# EAGLE design osc (EAGLE 6.1)
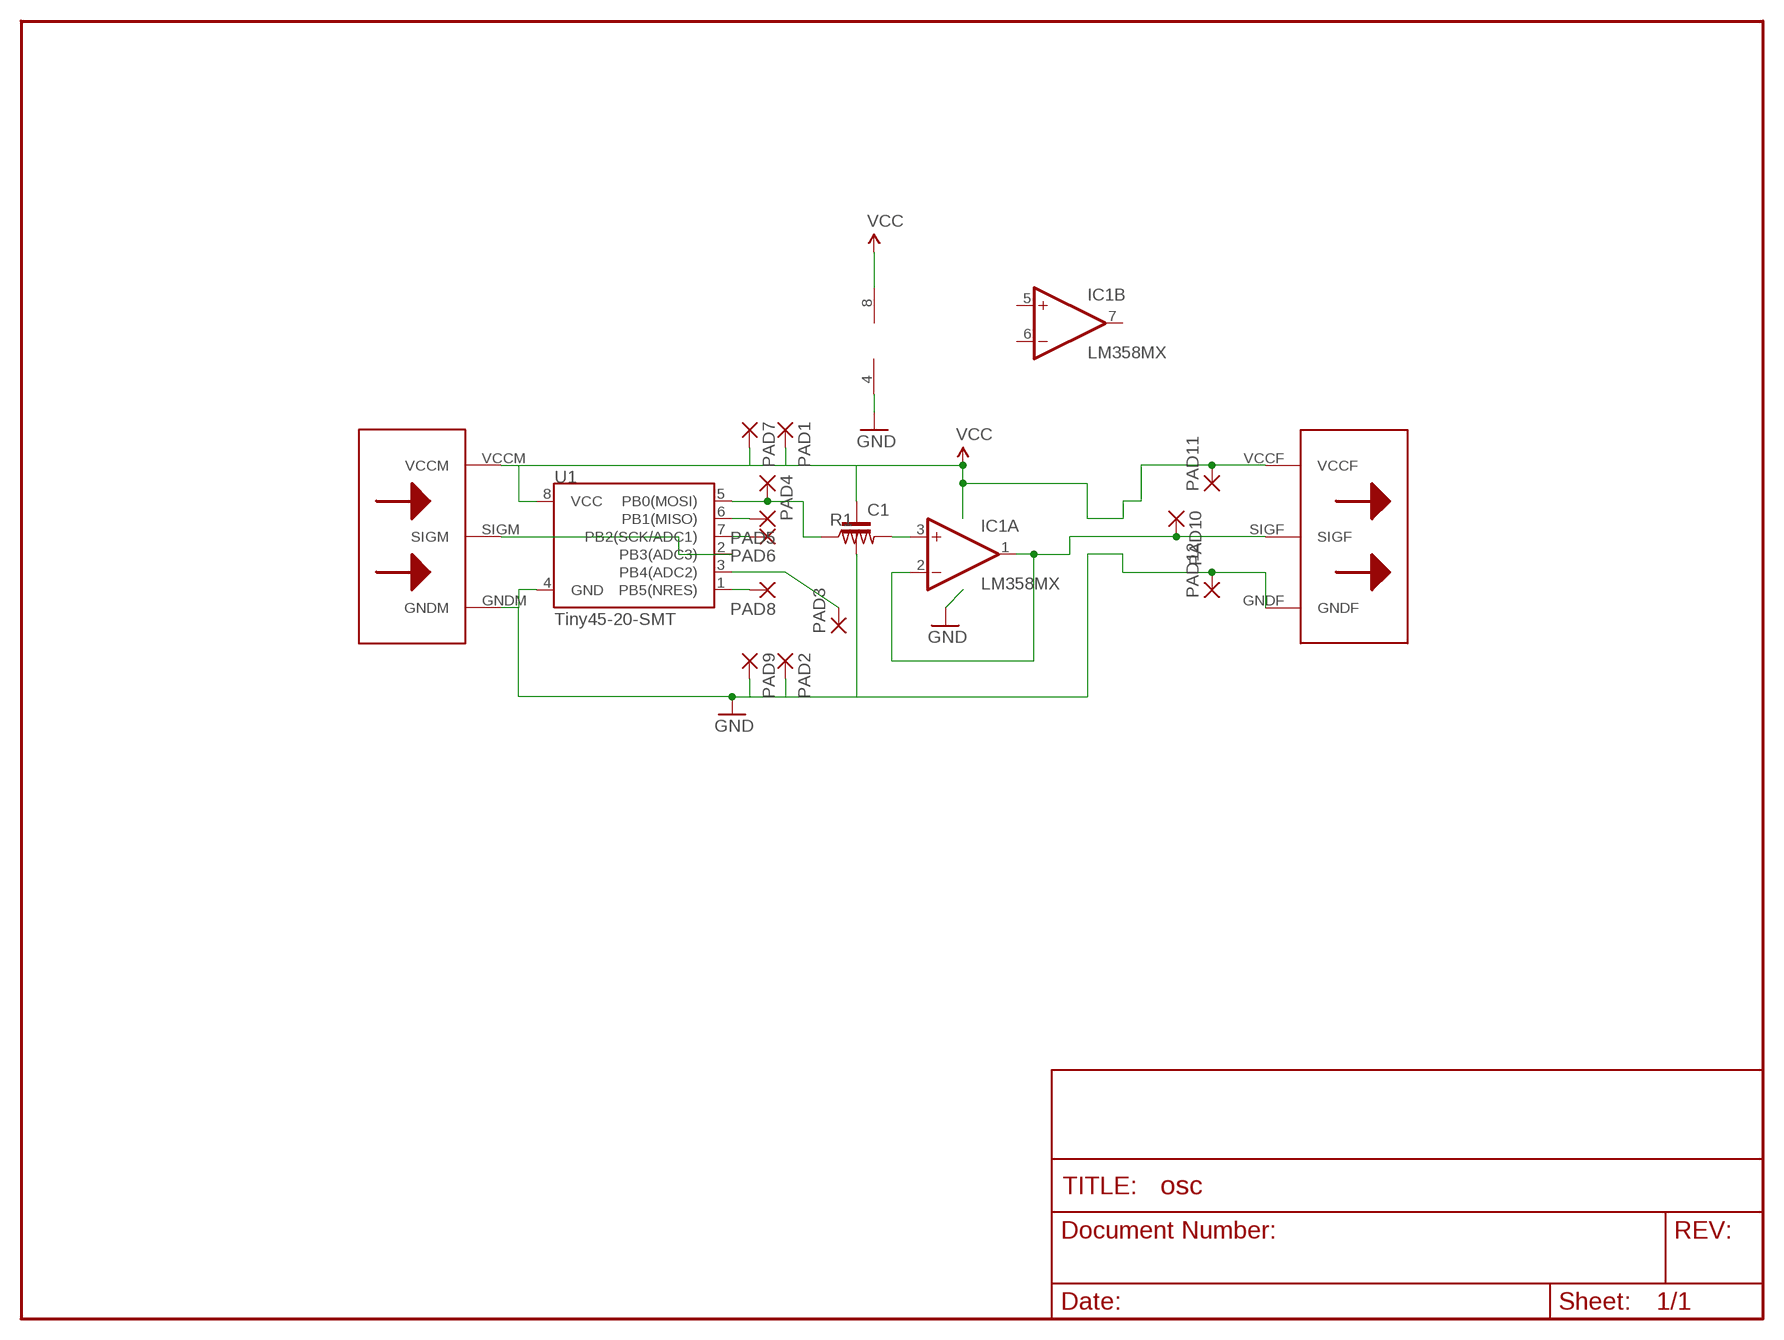
[diagram p0: schematic, sheet 1]

## Parts
C1  C-EUC1206K  [C1206K]
IC1  LM358MX  [SO08]
PAD1  SMD2  [SMD1,27-2,54]
PAD2  SMD2  [SMD1,27-2,54]
PAD3  SMD2  [SMD1,27-2,54]
PAD4  SMD2  [SMD1,27-2,54]
PAD5  SMD2  [SMD1,27-2,54]
PAD6  SMD2  [SMD1,27-2,54]
PAD7  SMD2  [SMD1,27-2,54]
PAD8  SMD2  [SMD1,27-2,54]
PAD9  SMD2  [SMD1,27-2,54]
PAD10  SMD2  [SMD1,27-2,54]
PAD11  SMD2  [SMD1,27-2,54]
PAD12  SMD2  [SMD1,27-2,54]
R1  R-US_R0805  [R0805]
U1  Tiny45-20-SMT  ATTINY45TINY45-20-SMT  [SO08-EIAJ]
U$6  BIGBIT  [BIGBIT]

## Nets
GND: C1.2 IC1.4(P:V-) PAD2.1(P) PAD9.1(P) PAD12.1(P) U1.4(GND) U$6.GNDF U$6.GNDM
N$1: PAD4.1(P) R1.1 U1.5(PB0(MOSI))
N$2: U1.2(PB3(ADC3)) U$6.SIGM
N$3: IC1.3(A:+IN) R1.2
N$5: PAD3.1(P) U1.3(PB4(ADC2))
N$6: PAD8.1(P) U1.1(PB5(NRES))
N$8: PAD6.1(P) U1.7(PB2(SCK/ADC1))
N$9: PAD5.1(P) U1.6(PB1(MISO))
POT: IC1.1(A:OUT) IC1.2(A:-IN) PAD10.1(P) U$6.SIGF
VCC: C1.1 IC1.8(P:V+) PAD1.1(P) PAD7.1(P) PAD11.1(P) U1.8(VCC) U$6.VCCF U$6.VCCM
Unconnected: IC1.5(B:+IN) IC1.6(B:-IN) IC1.7(B:OUT)

## Library data of the parts
C1 = rcl:C-EU: CAPACITOR, European symbol
IC1 = linear:LM358: OP AMP also LM158; LM258; LM2904 Source: http://cache.national.com/ds/LM/LM158.pdf
PAD1-PAD12 = wirepad:SMD2: SMD PAD
R1 = rcl:R-US_: RESISTOR, American symbol
U1 = SparkFun-DigitalIC:ATTINY45: Atmel 8-pin 2/4/8kB flash uC; PROD_ID: IC-08922
U$6 = bigbits:BIGBIT: BigBit completo Male entra o Sinal Female sai o Sinal Esquerda --> Direita

## Board
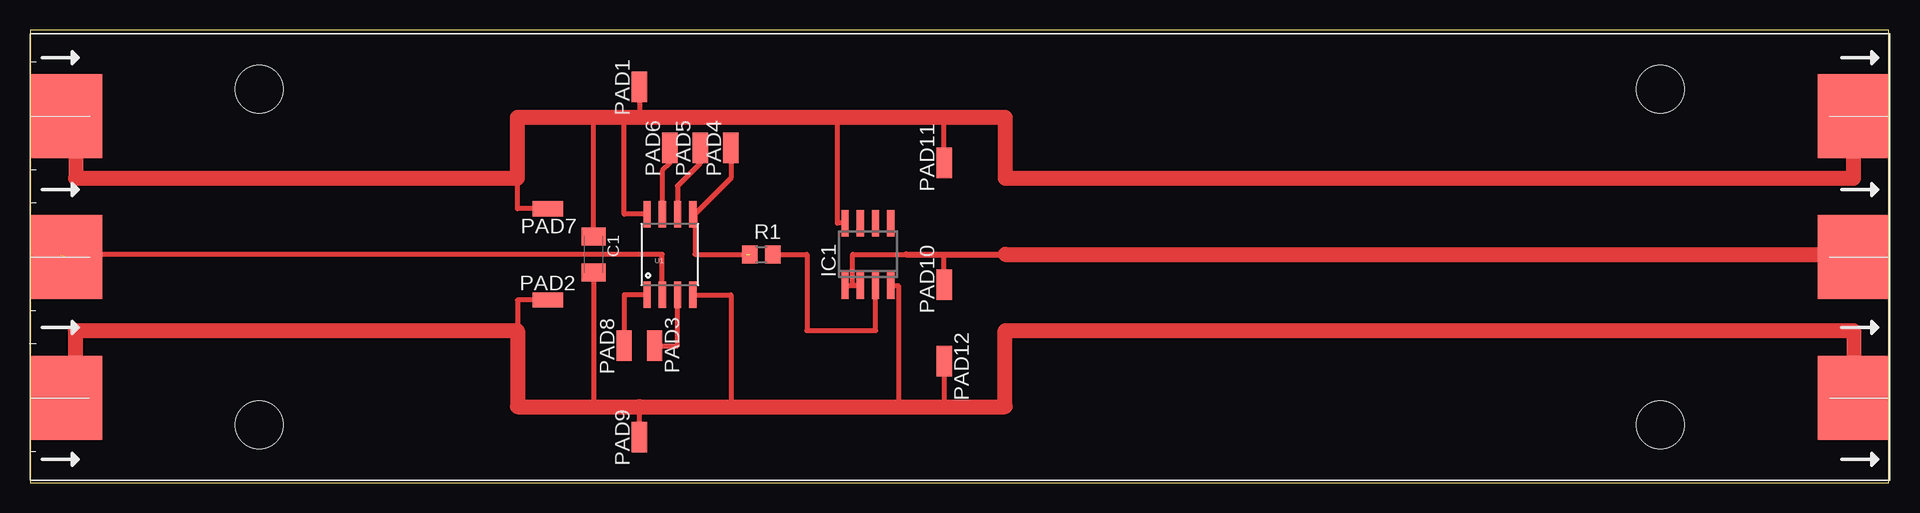
[diagram p1: board, top side]

Size 154.92 x 37.77 mm. Coordinates in mm from the lower left corner, seen from the top.
Outline: 0,0 154.92,0 154.92,37.77 0,37.77 0,0
Copper layers (1*16): Top 0.035mm / dielectric 1.5mm / Bottom 0.035mm
Design rules: minimum track width 10mil, minimum drill 24mil, track to track 8mil, track to pad 8mil, pad to pad 8mil, via to via 8mil, smd to smd 8mil, copper to edge 40mil, drill to drill 8mil, minimum pad ring 10mil, minimum via ring 8mil, stop-mask expansion 4mil, vias tented up to drill 0mil, thermal gap 10mil

### Footprints (pad centres in the part's own frame; a part is rotated, then mirrored left to right if it is on the bottom)
C1206K = smd 1.5 x 2: 1 -1.5,0; 2 1.5,0
SO08 = smd 0.6 x 2.2: 1 -1.905,-2.6; 2 -0.635,-2.6; 3 0.635,-2.6; 4 1.905,-2.6; 5 1.905,2.6; 6 0.635,2.6; 7 -0.635,2.6; 8 -1.905,2.6
SMD1,27-2,54 = smd 1.27 x 2.54: 1 0,0
R0805 = smd 1.3 x 1.5: 1 -0.95,0; 2 0.95,0
SO08-EIAJ = smd 0.61 x 2.21: 1 -1.905,-3.378; 2 -0.635,-3.378; 3 0.635,-3.378; 4 1.905,-3.378; 5 1.905,3.353; 6 0.635,3.353; 7 -0.635,3.353; 8 -1.905,3.353
BIGBIT = smd 6 x 7: GNDF 152,-30.38; GNDM 3,-30.38; SIGF 152,-18.64; SIGM 3,-18.64; VCCF 152,-6.89; VCCM 3,-6.89 | hole 4: 135.9,-4.64; 135.9,-32.639; 19.1,-4.64; 19.1,-32.639

### Placement (x,y rotation side)
C1  46.99,19.05 270 top
IC1  69.85,19.05 0 top
PAD1  50.8,33.02 0 top
PAD2  43.18,15.24 270 top
PAD3  52.07,11.43 180 top
PAD4  58.42,27.94 0 top
PAD5  55.88,27.94 0 top
PAD6  53.34,27.94 0 top
PAD7  43.18,22.86 90 top
PAD8  49.53,11.43 0 top
PAD9  50.8,3.81 0 top
PAD10  76.2,16.51 0 top
PAD11  76.2,26.67 0 top
PAD12  76.2,10.16 180 top
R1  60.96,19.05 0 top
U1  53.34,19.05 0 top
U$6  0,37.47 0 top

### Tracks (layer width: path | path; a pad name or v marks a point on that pad's centre or on a via)
GND
  Top 0.406: PAD2.1 40.64,15.24 40.64,12.7 | PAD9.1 50.8,6.35 | U1.4 58.42,15.67 58.42,6.35 | C1.2 46.99,6.35 | PAD12.1 76.2,6.35 | IC1.4 72.39,16.45 72.39,6.35
  Top 1.27: U$6.GNDM 3.81,7.08 3.81,12.7 40.64,12.7 40.64,6.35 46.99,6.35 50.8,6.35 58.42,6.35 72.39,6.35 76.2,6.35 81.28,6.35 81.28,12.7 152,12.7 U$6.GNDF
N$1  (1 unrouted)
  Top 0.406: 59.69,19.05 55.42,19.05 55.42,22.4 | PAD4.1 58.42,25.4 55.42,22.4 | 55.42,22.4 U1.5
N$2  (1 unrouted)
  Top 0.406: U1.2 52.7,19.05 2.54,19.05
N$3
  Top 0.406: R1.2 64.77,19.05 64.77,12.7 70.48,12.7 IC1.3
N$4
  Top 0.508: 73.03,19.05 81.28,19.05
  Top 1.27: 81.28,19.05 151.76,19.05
N$5
  Top 0.406: PAD3.1 53.98,11.43 U1.3
N$6
  Top 0.406: U1.1 49.53,15.67 PAD8.1
N$8
  Top 0.406: PAD6.1 53.34,26.67 52.7,26.04 U1.7
N$9
  Top 0.406: U1.6 53.98,24.77 55.88,26.67 PAD5.1
POT
  Top 0.406: PAD10.1 76.2,19.05 | IC1.1 IC1.2 68.58,16.45 68.58,19.05 76.2,19.05 | 76.2,19.05 152,19.05 U$6.SIGF
VCC
  Top 0.406: U1.8 49.53,22.4 49.53,30.48 | PAD1.1 50.8,30.48 | PAD7.1 40.64,22.86 40.64,25.4 | C1.1 46.99,30.48 | PAD11.1 76.2,30.48 | IC1.8 67.31,21.65 67.31,30.48
  Top 1.27: U$6.VCCM 3.81,30.57 3.81,25.4 40.64,25.4 40.64,30.48 46.99,30.48 49.53,30.48 50.8,30.48 67.31,30.48 76.2,30.48 81.28,30.48 81.28,25.4 152,25.4 U$6.VCCF